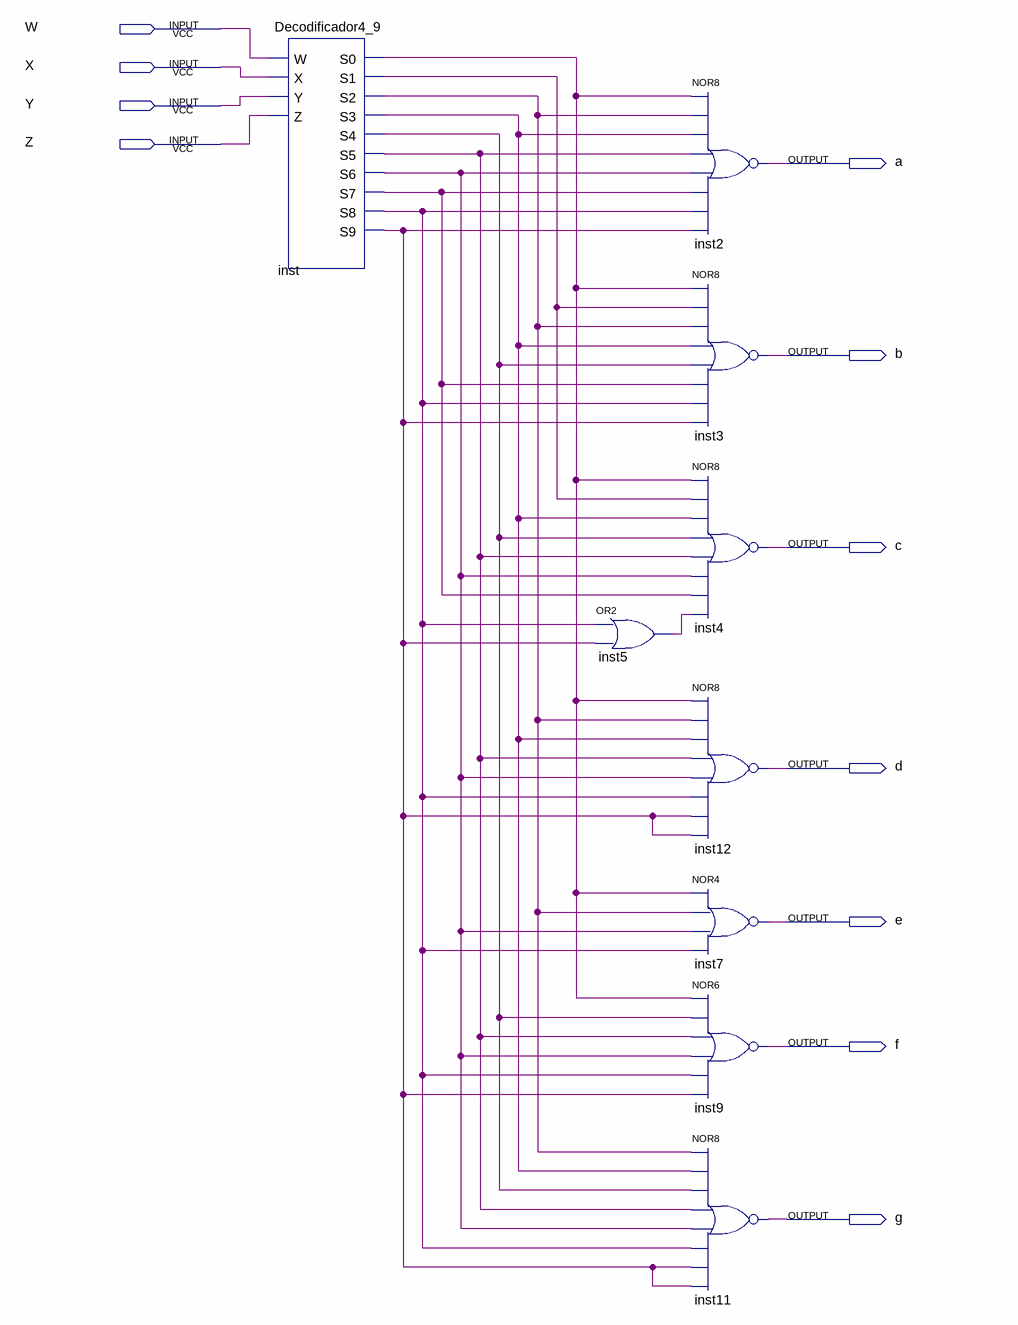
[diagram p0: schematic sheet]
// Quartus schematic DecodificadorFinal.bdf as structural Verilog: 9 symbols, 11 pins
module DecodificadorFinal (
  input  W,
  input  X,
  input  Y,
  input  Z,
  output a,
  output b,
  output c,
  output d,
  output e,
  output f,
  output g
);

  wire inst5_out, inst_s0, inst_s1, inst_s2, inst_s3, inst_s4, inst_s5, inst_s6, inst_s7, inst_s8, inst_s9;

  Decodificador4_9 inst (
    .W(W), .X(X), .Y(Y), .Z(Z), .S0(inst_s0), .S1(inst_s1), .S2(inst_s2), .S3(inst_s3), .S4(inst_s4),
    .S5(inst_s5), .S6(inst_s6), .S7(inst_s7), .S8(inst_s8), .S9(inst_s9));
  or inst5 (inst5_out, inst_s8, inst_s9);
  nor inst2 (a, inst_s0, inst_s2, inst_s3, inst_s5, inst_s6, inst_s7, inst_s8, inst_s9);
  nor inst3 (b, inst_s0, inst_s1, inst_s2, inst_s3, inst_s4, inst_s7, inst_s8, inst_s9);
  nor inst4 (c, inst_s0, inst_s1, inst_s3, inst_s4, inst_s5, inst_s6, inst_s7, inst5_out);
  nor inst12 (d, inst_s0, inst_s2, inst_s3, inst_s5, inst_s6, inst_s8, inst_s9, inst_s9);
  nor inst7 (e, inst_s0, inst_s2, inst_s6, inst_s8);
  nor inst9 (f, inst_s0, inst_s4, inst_s5, inst_s6, inst_s8, inst_s9);
  nor inst11 (g, inst_s2, inst_s3, inst_s4, inst_s5, inst_s6, inst_s8, inst_s9, inst_s9);
endmodule
